# EAGLE design MEGA-ROS (EAGLE 7.6.0)
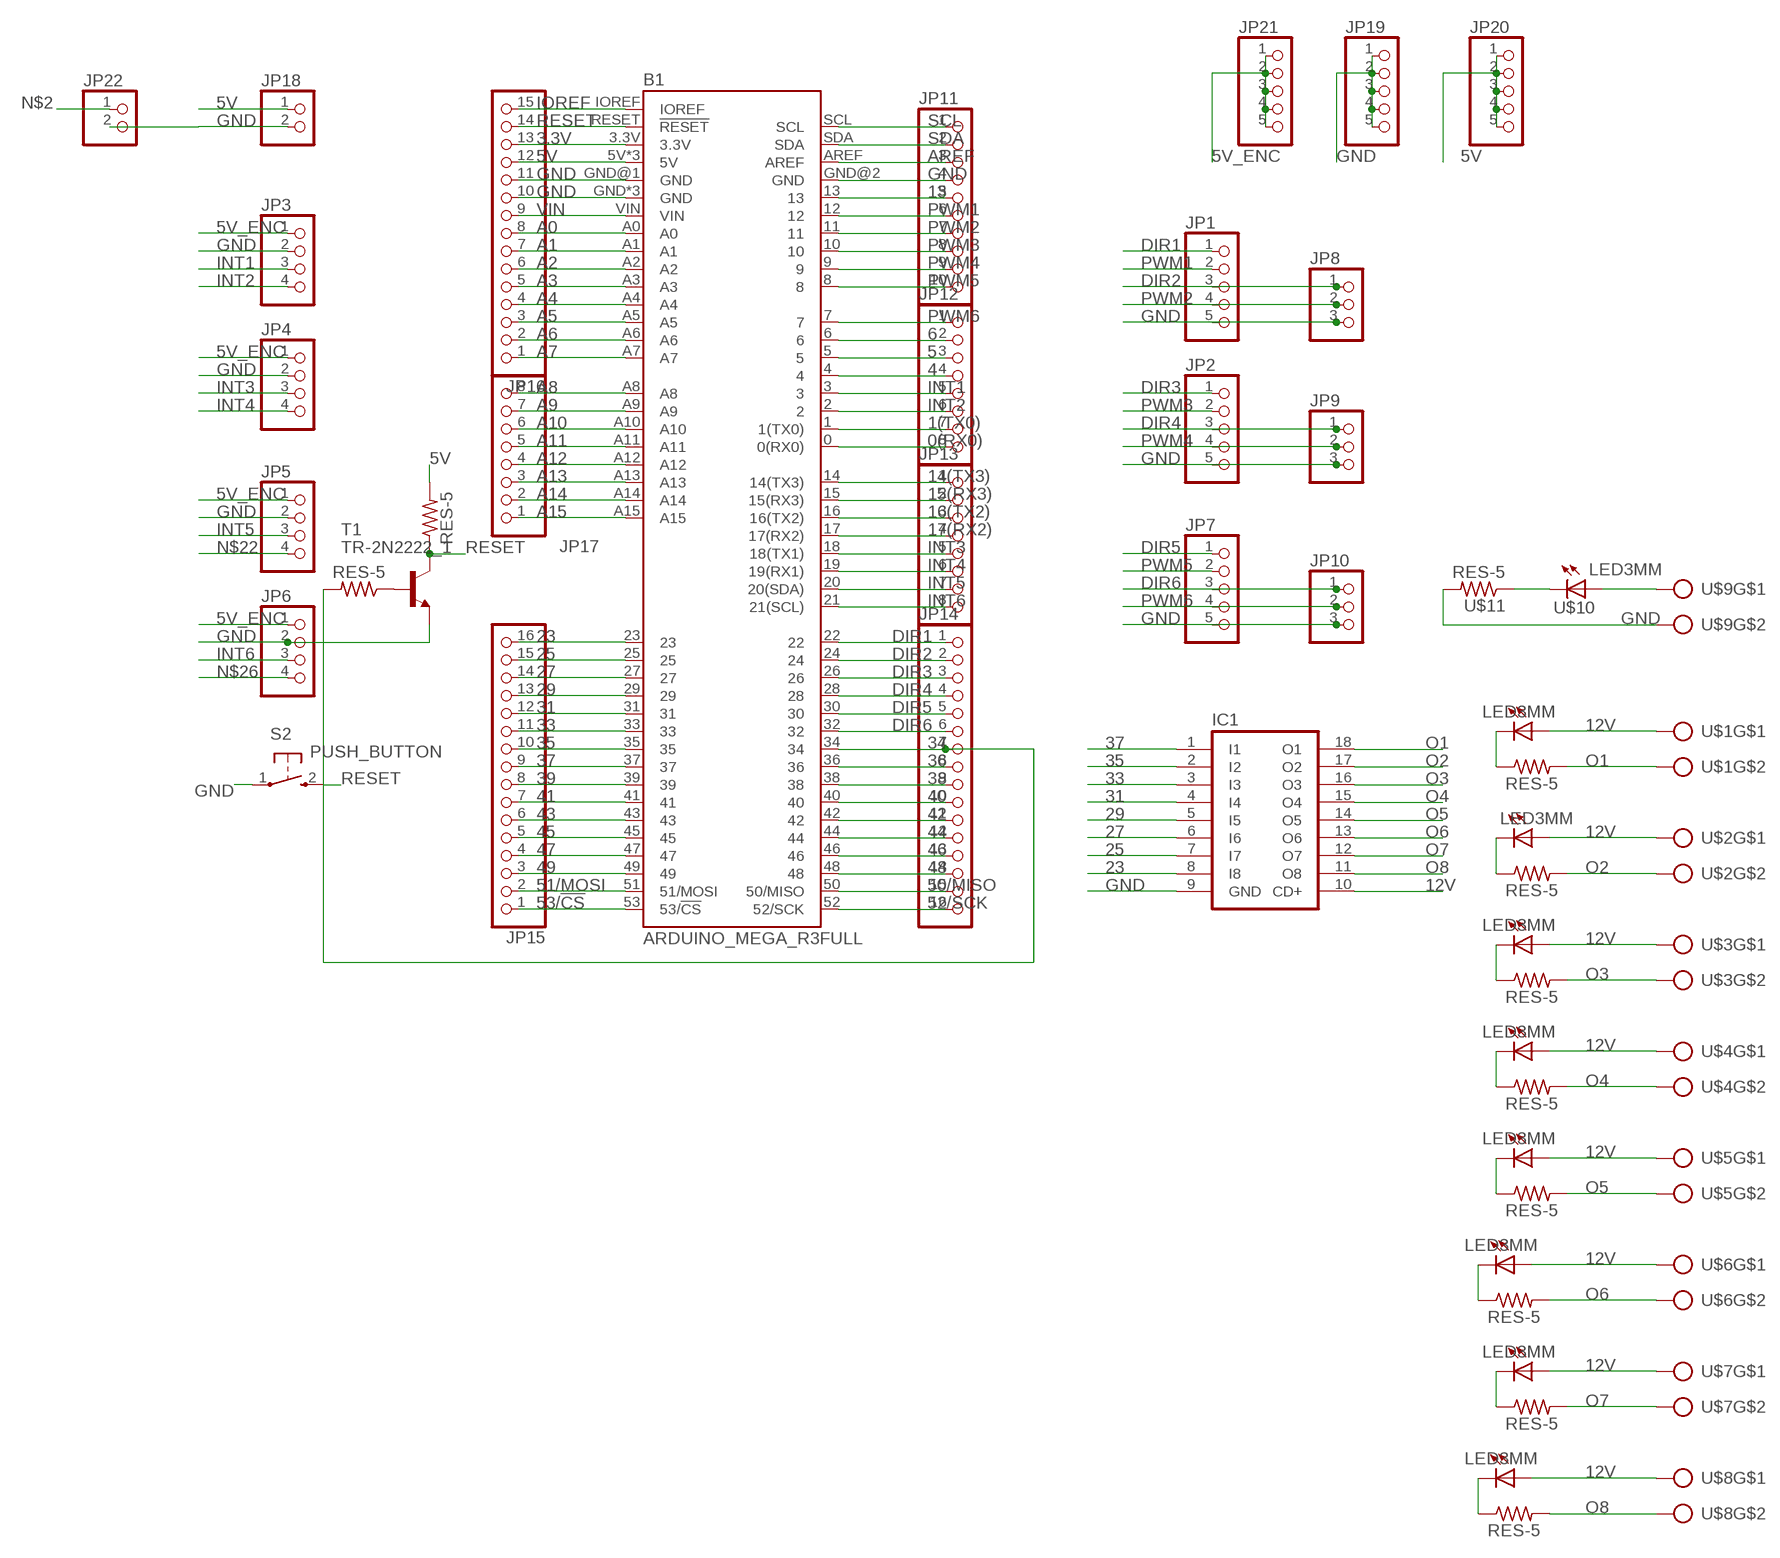
[diagram p0: schematic, sheet 1]

## Parts
B1  ARDUINO_MEGA_R3FULL  [ARDUINO_MEGA_NO_SILK]
IC1  ULN2803A  [DIL18]
JP1  PINHD-5_DATA  [1X05_DATA]
JP2  PINHD-5_DATA  [1X05_DATA]
JP3  PINHD-4_DATA  [1X04_DATA]
JP4  PINHD-4_DATA  [1X04_DATA]
JP5  PINHD-4_DATA  [1X04_DATA]
JP6  PINHD-4_DATA  [1X04_DATA]
JP7  PINHD-5_DATA  [1X05_DATA]
JP8  PINHD-3_DATA  [1X03_DATA]
JP9  PINHD-3_DATA  [1X03_DATA]
JP10  PINHD-3_DATA  [1X03_DATA]
JP11  PINHD-1X10  [1X10]
JP12  PINHD-1X8  [1X08]
JP13  PINHD-1X8  [1X08]
JP14  PINHD-1X16  [1X16]
JP15  PINHD-1X16  [1X16]
JP16  PINHD-1X15  [1X15]
JP17  PINHD-1X8  [1X08]
JP18  PINHD-2_DATA  [1X02_DATA]
JP19  PINHD-1X5  [1X05]
JP20  PINHD-1X5  [1X05]
JP21  PINHD-1X5  [1X05]
JP22  PINHD-2_DATA  [1X02_DATA]
S2  PUSH_BUTTON  [B3F-10XX]
T1  TR-2N2222_1  [TO92-EBC]
U$1  CON_PTR_2  [AK300/2]
U$2  CON_PTR_2  [AK300/2]
U$3  CON_PTR_2  [AK300/2]
U$4  CON_PTR_2  [AK300/2]
U$5  CON_PTR_2  [AK300/2]
U$6  CON_PTR_2  [AK300/2]
U$7  CON_PTR_2  [AK300/2]
U$8  CON_PTR_2  [AK300/2]
U$9  CON_PTR_2  [AK300/2]
U$10  LED3MM  [LED3MM]
U$11  RES-5  [0204/5]
U$12  LED3MM  [LED3MM]
U$13  RES-5  [0204/5]
U$14  LED3MM  [LED3MM]
U$15  RES-5  [0204/5]
U$16  LED3MM  [LED3MM]
U$17  RES-5  [0204/5]
U$18  LED3MM  [LED3MM]
U$19  RES-5  [0204/5]
U$20  LED3MM  [LED3MM]
U$21  RES-5  [0204/5]
U$22  LED3MM  [LED3MM]
U$23  RES-5  [0204/5]
U$24  LED3MM  [LED3MM]
U$25  RES-5  [0204/5]
U$26  LED3MM  [LED3MM]
U$27  RES-5  [0204/5]
U$28  RES-5  [0204/5]
U$29  RES-5  [0204/5]

## Nets
0(RX0): B1.0(0(RX0)) JP12.8
1(TX0): B1.1(1(TX0)) JP12.7
3.3V: B1.3.3V JP16.13
4: B1.4 JP12.4
5: B1.5 JP12.3
5V: B1.5V B1.5V@1(5V) B1.5V@2(5V) JP16.12 JP18.1 JP20.1 JP20.2 JP20.3 JP20.4 JP20.5 U$28.2
5V_ENC: JP3.1 JP4.1 JP5.1 JP6.1 JP21.1 JP21.2 JP21.3 JP21.4 JP21.5
6: B1.6 JP12.2
12V: IC1.10(CD+) U$1.1 U$2.1 U$3.1 U$4.1 U$5.1 U$6.1 U$7.1 U$8.1 U$12.A U$14.A U$16.A U$18.A U$20.A U$22.A U$24.A U$26.A
13: B1.13 JP11.5
14(TX3): B1.14(14(TX3)) JP13.1
15(RX3): B1.15(15(RX3)) JP13.2
16(TX2): B1.16(16(TX2)) JP13.3
17(RX2): B1.17(17(RX2)) JP13.4
23: B1.23 IC1.8(I8) JP15.16
25: B1.25 IC1.7(I7) JP15.15
27: B1.27 IC1.6(I6) JP15.14
29: B1.29 IC1.5(I5) JP15.13
31: B1.31 IC1.4(I4) JP15.12
33: B1.33 IC1.3(I3) JP15.11
34: B1.34 JP14.7 U$29.2
35: B1.35 IC1.2(I2) JP15.10
36: B1.36 JP14.8
37: B1.37 IC1.1(I1) JP15.9
38: B1.38 JP14.9
39: B1.39 JP15.8
40: B1.40 JP14.10
41: B1.41 JP15.7
42: B1.42 JP14.11
43: B1.43 JP15.6
44: B1.44 JP14.12
45: B1.45 JP15.5
46: B1.46 JP14.13
47: B1.47 JP15.4
48: B1.48 JP14.14
49: B1.49 JP15.3
50/MISO: B1.50(50/MISO) JP14.15
51/MOSI: B1.51(51/MOSI) JP15.2
52/SCK: B1.52(52/SCK) JP14.16
53/!CS: B1.53(53/!CS) JP15.1
A0: B1.A0 JP16.8
A1: B1.A1 JP16.7
A2: B1.A2 JP16.6
A3: B1.A3 JP16.5
A4: B1.A4 JP16.4
A5: B1.A5 JP16.3
A6: B1.A6 JP16.2
A7: B1.A7 JP16.1
A8: B1.A8 JP17.8
A9: B1.A9 JP17.7
A10: B1.A10 JP17.6
A11: B1.A11 JP17.5
A12: B1.A12 JP17.4
A13: B1.A13 JP17.3
A14: B1.A14 JP17.2
A15: B1.A15 JP17.1
AREF: B1.AREF JP11.3
DIR1: B1.22 JP1.1 JP14.1
DIR2: B1.24 JP1.3 JP8.1 JP14.2
DIR3: B1.26 JP2.1 JP14.3
DIR4: B1.28 JP2.3 JP9.1 JP14.4
DIR5: B1.30 JP7.1 JP14.5
DIR6: B1.32 JP7.3 JP10.1 JP14.6
GND: B1.GND B1.GND@1(GND) B1.GND@2(GND) B1.GND@3(GND) B1.GND@4(GND) IC1.9(GND) JP1.5 JP2.5 JP3.2 JP4.2 JP5.2 JP6.2 JP7.5 JP8.3 JP9.3 JP10.3 JP11.4 JP16.10 JP16.11 JP18.2 JP19.1 JP19.2 JP19.3 JP19.4 JP19.5 JP22.2 S2.1(P) T1.E U$9.2 U$11.2
INT1: B1.3 JP3.3 JP12.5
INT2: B1.2 JP3.4 JP12.6
INT3: B1.18(18(TX1)) JP4.3 JP13.5
INT4: B1.19(19(RX1)) JP4.4 JP13.6
INT5: B1.20(20(SDA)) JP5.3 JP13.7
INT6: B1.21(21(SCL)) JP6.3 JP13.8
IOREF: B1.IOREF JP16.15
N$1: U$10.K(C) U$11.1
N$2: JP22.1
N$3: U$12.K(C) U$13.1
N$4: U$14.K(C) U$15.1
N$5: U$16.K(C) U$17.1
N$6: U$18.K(C) U$19.1
N$7: U$20.K(C) U$21.1
N$8: U$22.K(C) U$23.1
N$9: U$24.K(C) U$25.1
N$10: U$26.K(C) U$27.1
N$11: U$9.1 U$10.A
N$12: T1.B U$29.1
N$22: JP5.4
N$26: JP6.4
O1: IC1.18(O1) U$1.2 U$13.2
O2: IC1.17(O2) U$2.2 U$15.2
O3: IC1.16(O3) U$3.2 U$17.2
O4: IC1.15(O4) U$4.2 U$19.2
O5: IC1.14(O5) U$5.2 U$21.2
O6: IC1.13(O6) U$6.2 U$23.2
O7: IC1.12(O7) U$7.2 U$25.2
O8: IC1.11(O8) U$8.2 U$27.2
PWM1: B1.12 JP1.2 JP11.6
PWM2: B1.11 JP1.4 JP8.2 JP11.7
PWM3: B1.10 JP2.2 JP11.8
PWM4: B1.9 JP2.4 JP9.2 JP11.9
PWM5: B1.8 JP7.2 JP11.10
PWM6: B1.7 JP7.4 JP10.2 JP12.1
RESET: B1.RESET(!RESET) JP16.14 S2.2(S) T1.C U$28.1
SCL: B1.SCL JP11.1
SDA: B1.SDA JP11.2
VIN: B1.VIN JP16.9

## Library data of the parts
B1 = MIA_LIBRARY-2-2-2:ARDUINO_MEGA_R3: Arduino Mega R3 ATmega2560 R3 compatible footprint. SparkFun Products: Arduino Mega 2560 R3 <https://www.sparkfun.com/products/11061>
IC1 = MIA_LIBRARY-2-2-2:ULN2803A: DRIVER ARRAY
JP1 JP2 JP7 = MIA_LIBRARY-2-2-2:PINHD-5_DATA: PIN HEADER
JP3-JP6 = MIA_LIBRARY-2-2-2:PINHD-4_DATA: PIN HEADER
JP8-JP10 = MIA_LIBRARY-2-2-2:PINHD-3_DATA: PIN HEADER
JP11 = pinhead:PINHD-1X10: PIN HEADER
JP12 JP13 JP17 = pinhead:PINHD-1X8: PIN HEADER
JP14 JP15 = pinhead:PINHD-1X16: PIN HEADER
JP16 = pinhead:PINHD-1X15: PIN HEADER
JP18 JP22 = MIA_LIBRARY-2-2-2:PINHD-2_DATA: PIN HEADER
JP19-JP21 = pinhead:PINHD-1X5: PIN HEADER
S2 = MIA_LIBRARY-2-2-2:PUSH_BUTTON: OMRON SWITCH
T1 = MIA_LIBRARY-2-2-2:TR-2N2222_1: NPN TRANSISTOR
U$1-U$9 = MIA_LIBRARY-2-2-2:CON_PTR_2
U$10 U$12 U$14 U$16 U$18 U$20 U$22 U$24 U$26 = MIA_LIBRARY-2-2-2:LED3MM
U$11 U$13 U$15 U$17 U$19 U$21 U$23 U$25 U$27-U$29 = MIA_LIBRARY-2-2-2:RES-5

## Board
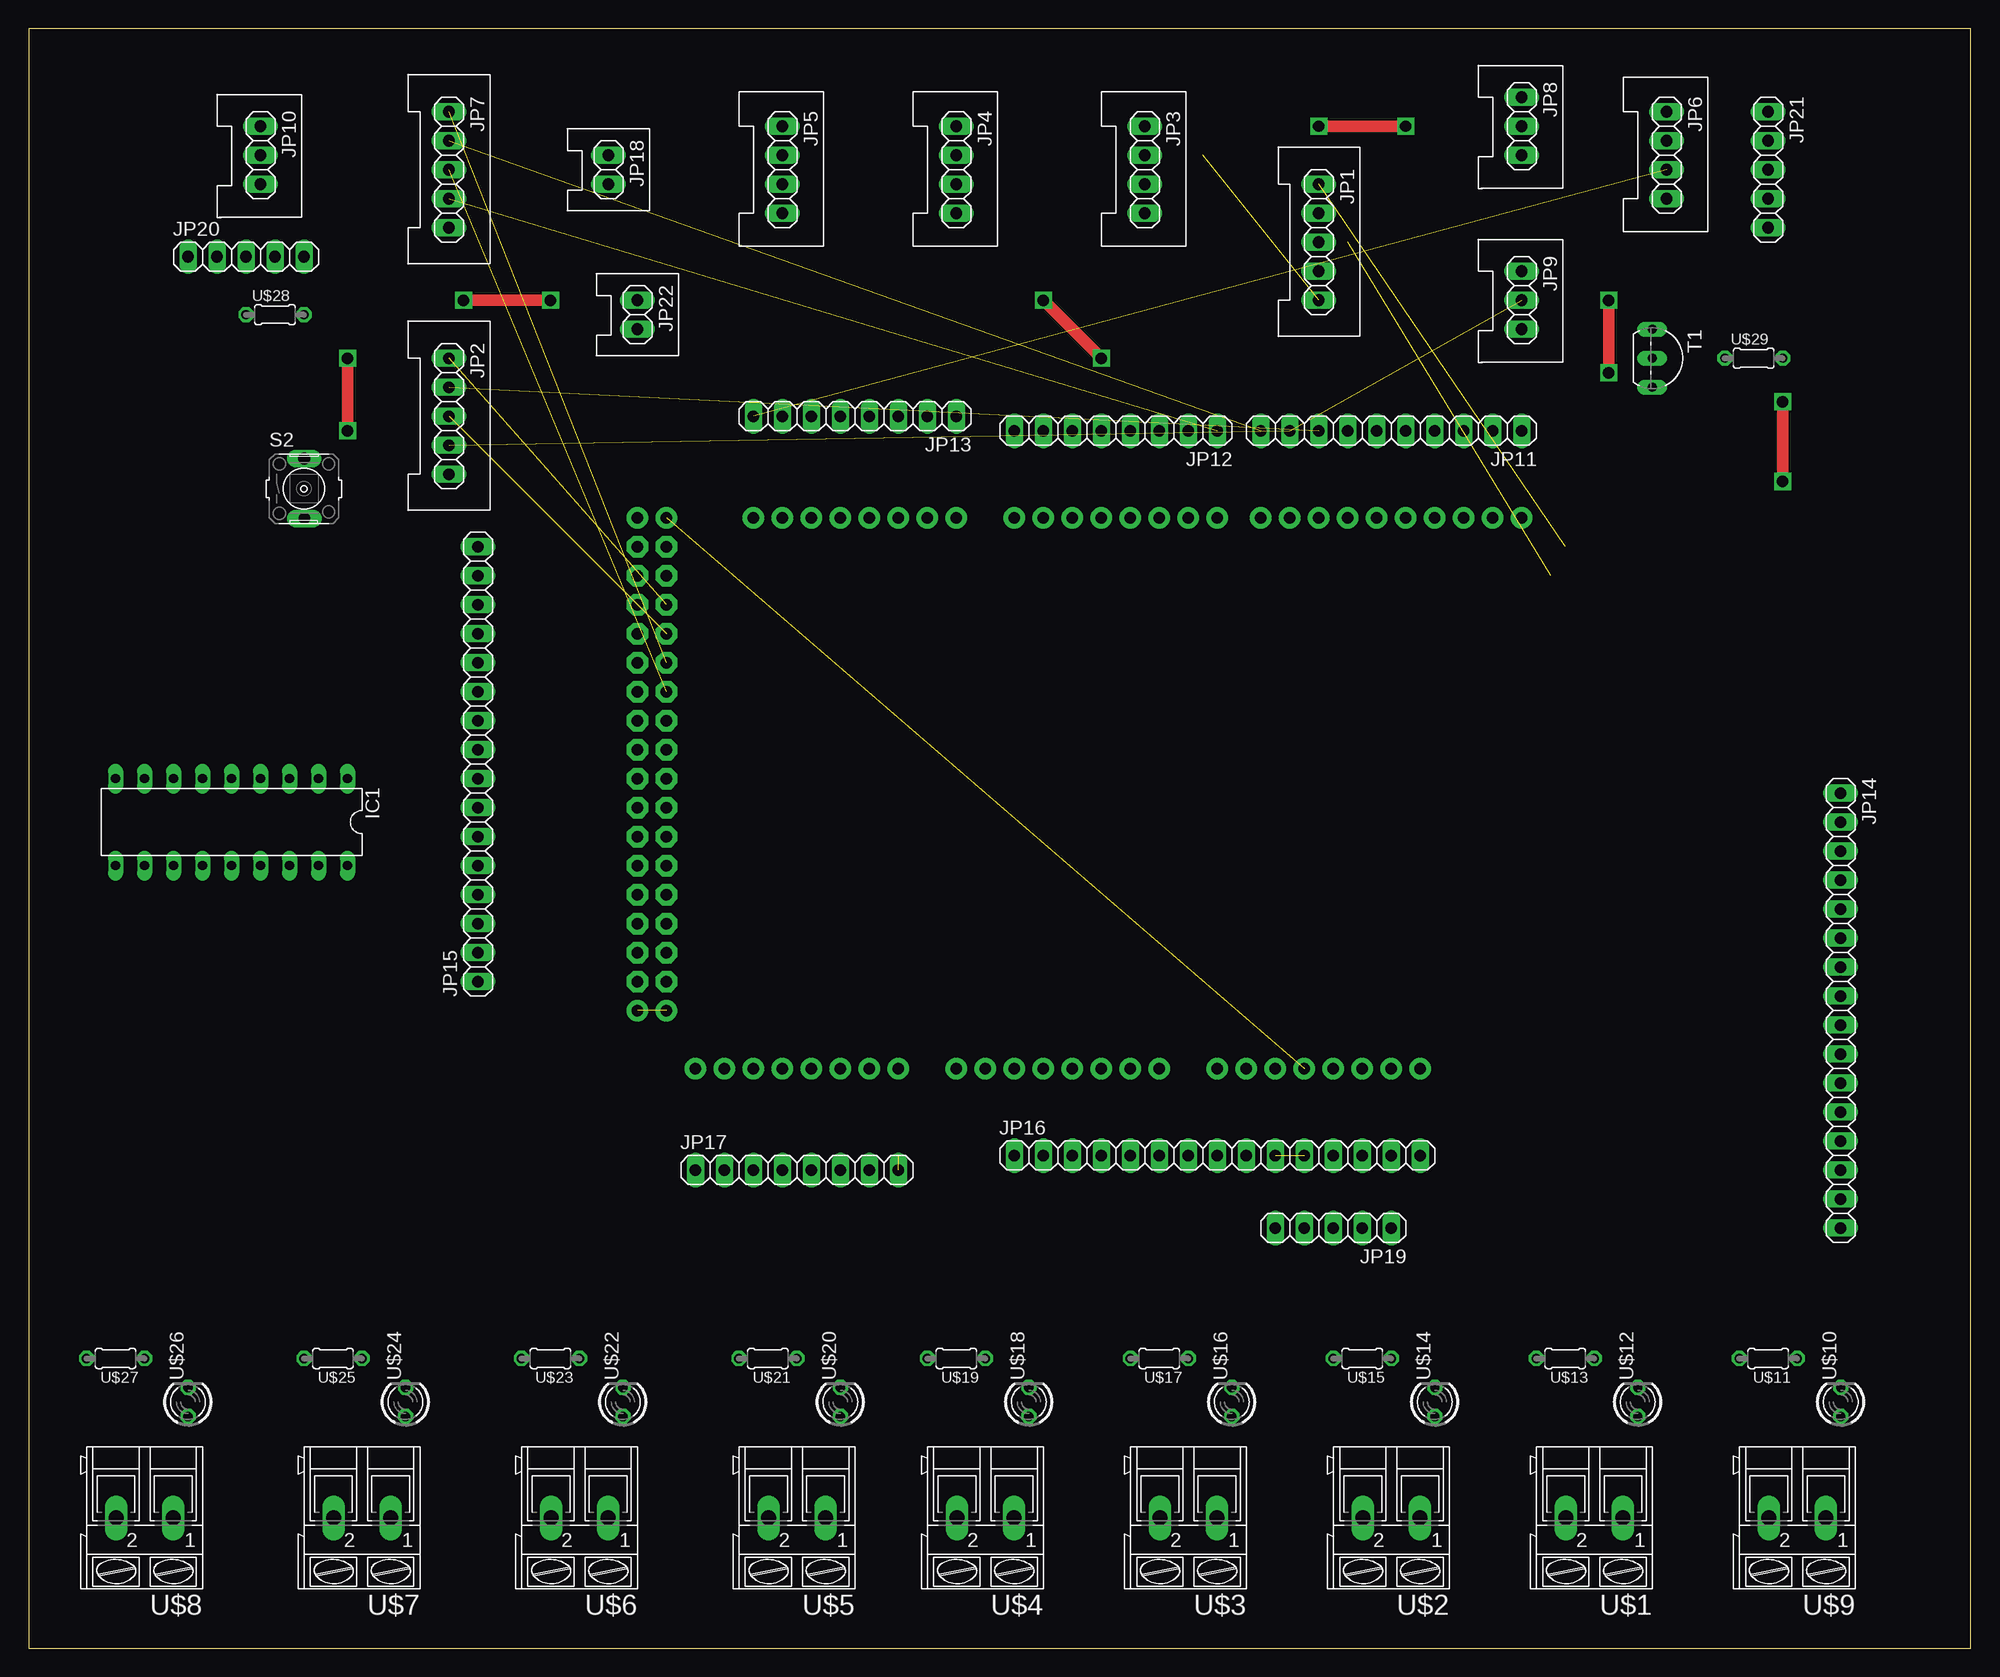
[diagram p1: board, top side]
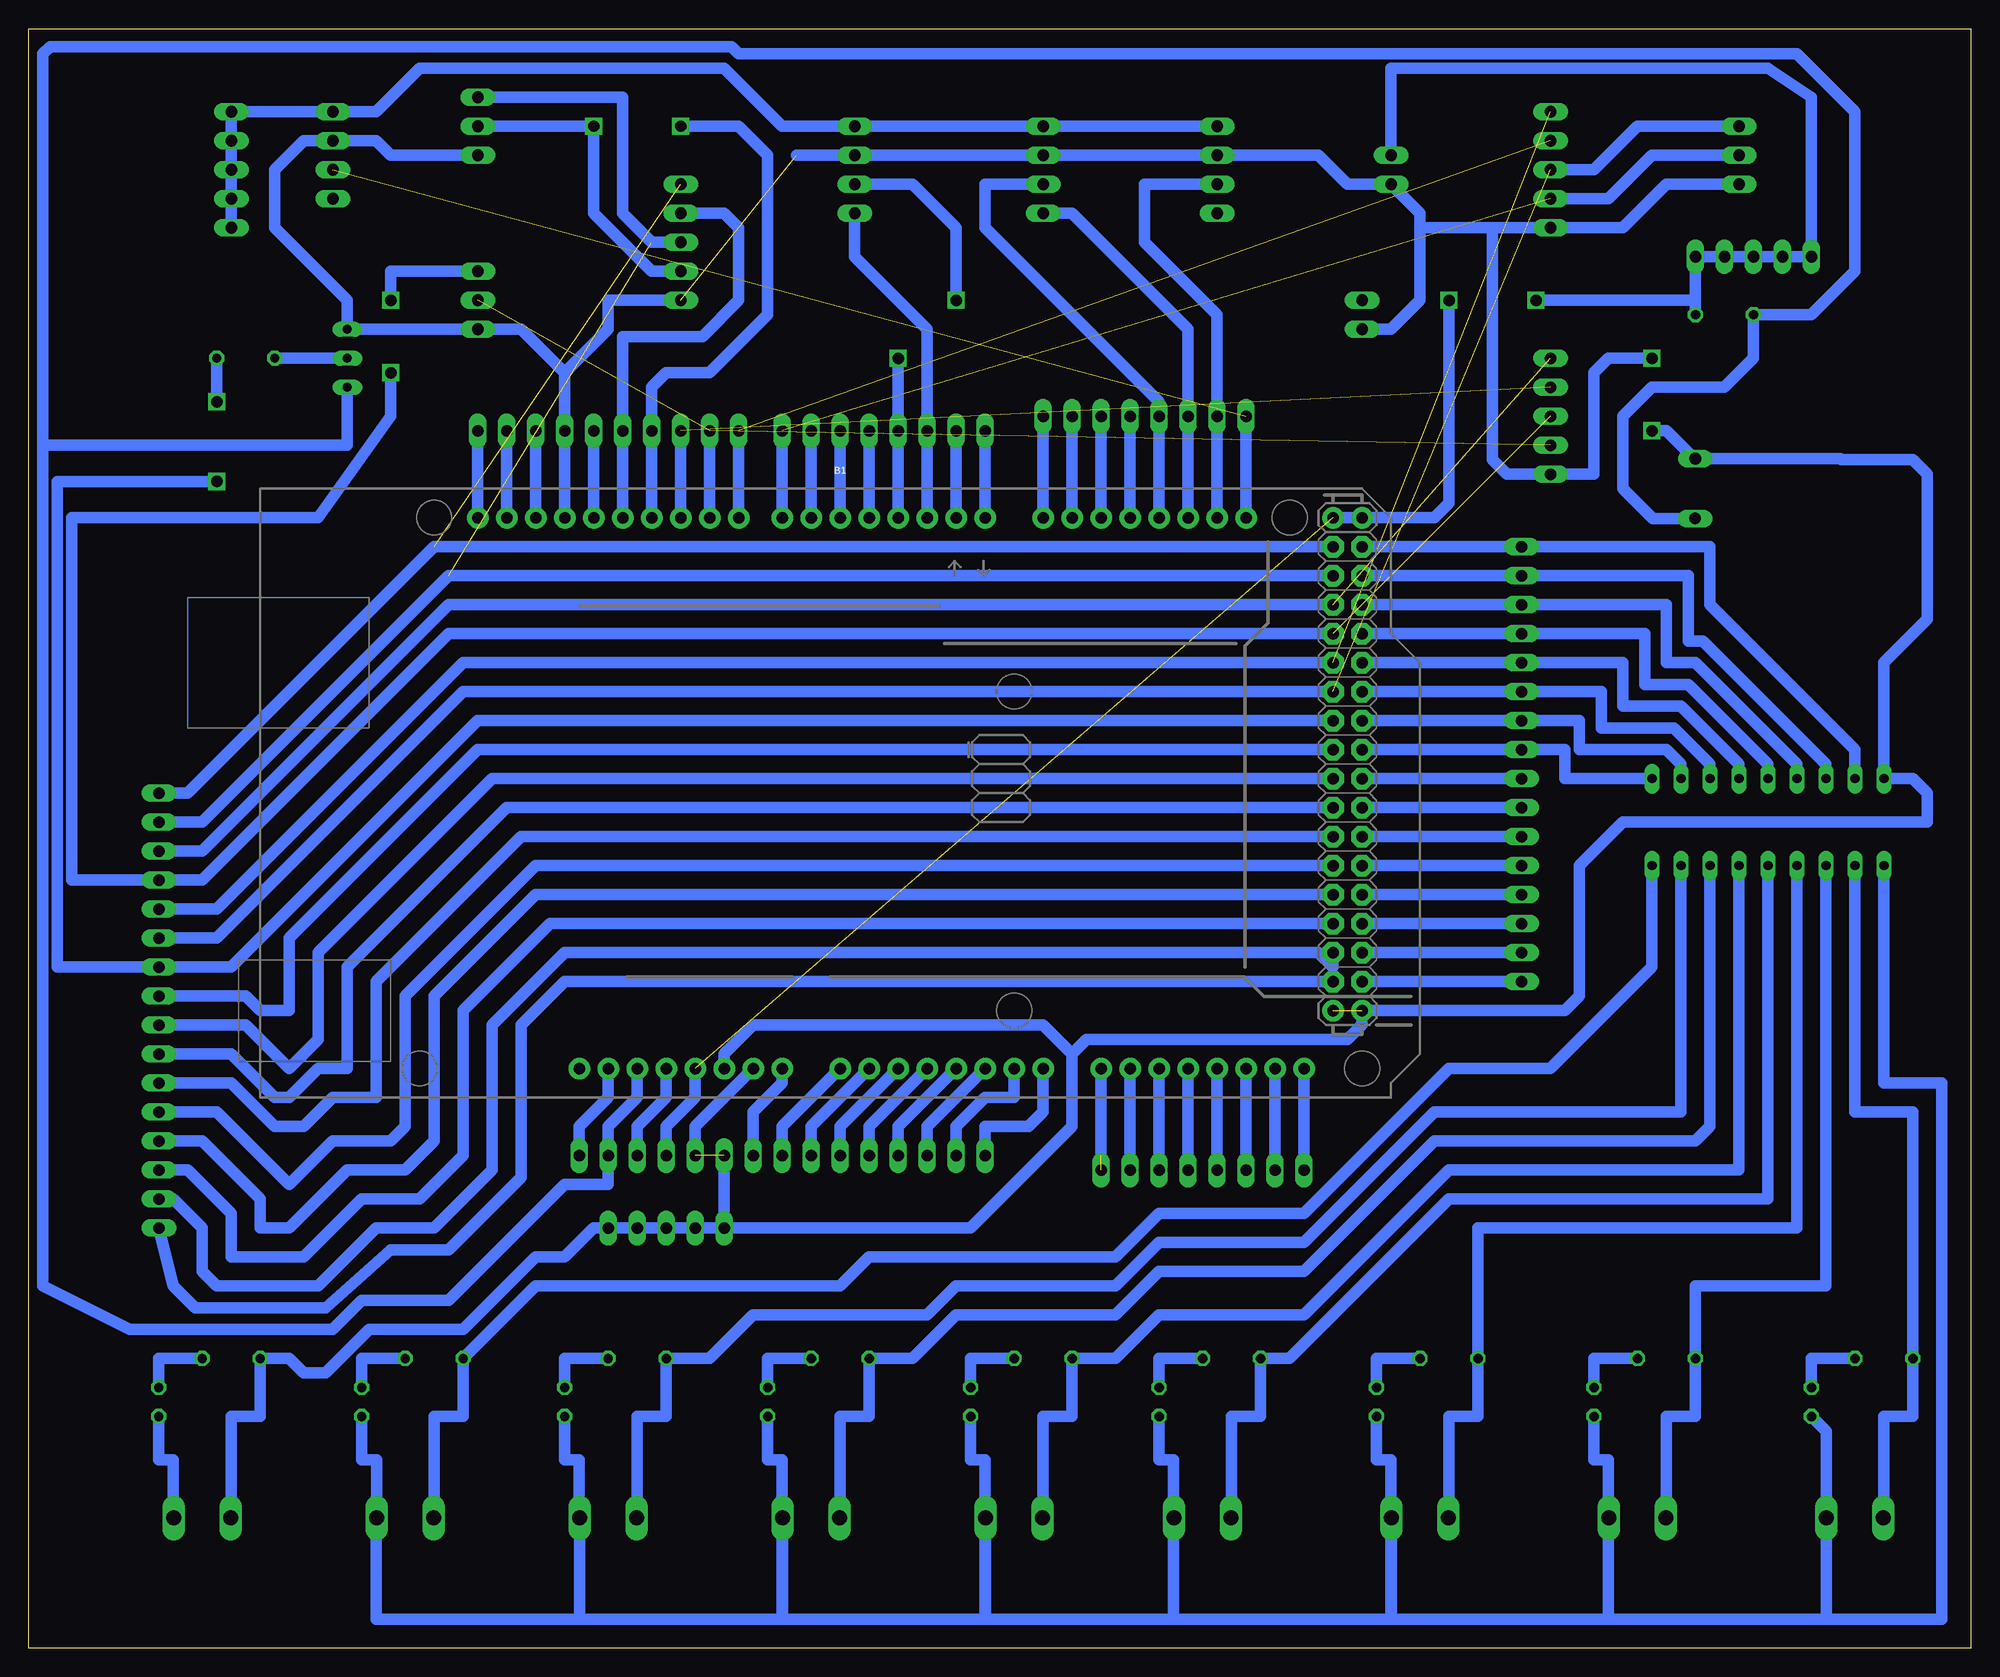
[diagram p2: board, bottom side, seen from below]

Size 170.16 x 141.91 mm. Coordinates in mm from the lower left corner, seen from the top.
Outline: 0,0 170.16,0 170.16,141.91 0,141.91 0,0
Copper layers (1*16): Top 0.035mm / dielectric 1.5mm / Bottom 0.035mm
Design rules "default": minimum track width 10mil, minimum drill 24mil, track to track 8mil, track to pad 8mil, pad to pad 8mil, via to via 8mil, smd to smd 8mil, copper to edge 40mil, drill to drill 8mil, minimum pad ring 10mil, minimum via ring 8mil, stop-mask expansion 4mil, vias tented up to drill 0mil, thermal gap 10mil

### Footprints (pad centres in the part's own frame; a part is rotated, then mirrored left to right if it is on the bottom)
ARDUINO_MEGA_NO_SILK = drill 1.016 pad 1.88: 0 13.97,24.13; 1 11.43,24.13; 2 8.89,24.13; 3 6.35,24.13; 3.3V -13.97,-24.13; 4 3.81,24.13; 5 1.27,24.13; 5V -11.43,-24.13; 5V@1 44.45,24.13; 5V@2 46.99,24.13; 6 -1.27,24.13; 7 -3.81,24.13; 8 -7.62,24.13; 9 -10.16,24.13; 10 -12.7,24.13; 11 -15.24,24.13; 12 -17.78,24.13; 13 -20.32,24.13; 14 19.05,24.13; 15 21.59,24.13; 16 24.13,24.13; 17 26.67,24.13; 18 29.21,24.13; 19 31.75,24.13; 20 34.29,24.13; 21 36.83,24.13; A0 1.27,-24.13; A1 3.81,-24.13; A2 6.35,-24.13; A3 8.89,-24.13; A4 11.43,-24.13; A5 13.97,-24.13; A6 16.51,-24.13; A7 19.05,-24.13; A8 24.13,-24.13; A9 26.67,-24.13; A10 29.21,-24.13; A11 31.75,-24.13; A12 34.29,-24.13; A13 36.83,-24.13; A14 39.37,-24.13; A15 41.91,-24.13; AREF -25.4,24.13; GND -8.89,-24.13; GND@1 -6.35,-24.13; GND@2 44.45,-19.05; GND@3 46.99,-19.05; GND@4 -22.86,24.13; IOREF -19.05,-24.13; NC -21.59,-24.13; RESET -16.51,-24.13; SCL -30.48,24.13; SDA -27.94,24.13; VIN -3.81,-24.13 | drill 1.016 pad 1.88 octagon: 22 44.45,21.59; 23 46.99,21.59; 24 44.45,19.05; 25 46.99,19.05; 26 44.45,16.51; 27 46.99,16.51; 28 44.45,13.97; 29 46.99,13.97; 30 44.45,11.43; 31 46.99,11.43; 32 44.45,8.89; 33 46.99,8.89; 34 44.45,6.35; 35 46.99,6.35; 36 44.45,3.81; 37 46.99,3.81; 38 44.45,1.27; 39 46.99,1.27; 40 44.45,-1.27; 41 46.99,-1.27; 42 44.45,-3.81; 43 46.99,-3.81; 44 44.45,-6.35; 45 46.99,-6.35; 46 44.45,-8.89; 47 46.99,-8.89; 48 44.45,-11.43; 49 46.99,-11.43; 50 44.45,-13.97; 51 46.99,-13.97; 52 44.45,-16.51; 53 46.99,-16.51
DIL18 = drill 0.813 long: 1 -10.16,-3.81; 2 -7.62,-3.81; 3 -5.08,-3.81; 4 -2.54,-3.81; 5 0,-3.81; 6 2.54,-3.81; 7 5.08,-3.81; 8 7.62,-3.81; 9 10.16,-3.81; 10 10.16,3.81; 11 7.62,3.81; 12 5.08,3.81; 13 2.54,3.81; 14 0,3.81; 15 -2.54,3.81; 16 -5.08,3.81; 17 -7.62,3.81; 18 -10.16,3.81
1X05_DATA = drill 1.016 long: 1 -5.08,0; 2 -2.54,0; 3 0,0; 4 2.54,0; 5 5.08,0
1X04_DATA = drill 1.016 long: 1 -3.81,0; 2 -1.27,0; 3 1.27,0; 4 3.81,0
1X03_DATA = drill 1.016 long: 1 -2.54,0; 2 0,0; 3 2.54,0
1X10 = drill 1.016 long: 1 -11.43,0; 2 -8.89,0; 3 -6.35,0; 4 -3.81,0; 5 -1.27,0; 6 1.27,0; 7 3.81,0; 8 6.35,0; 9 8.89,0; 10 11.43,0
1X08 = drill 1.016 long: 1 -8.89,0; 2 -6.35,0; 3 -3.81,0; 4 -1.27,0; 5 1.27,0; 6 3.81,0; 7 6.35,0; 8 8.89,0
1X16 = drill 1.016 long: 1 -19.05,0; 2 -16.51,0; 3 -13.97,0; 4 -11.43,0; 5 -8.89,0; 6 -6.35,0; 7 -3.81,0; 8 -1.27,0; 9 1.27,0; 10 3.81,0; 11 6.35,0; 12 8.89,0; 13 11.43,0; 14 13.97,0; 15 16.51,0; 16 19.05,0
1X15 = drill 1.016 long: 1 -17.78,0; 2 -15.24,0; 3 -12.7,0; 4 -10.16,0; 5 -7.62,0; 6 -5.08,0; 7 -2.54,0; 8 0,0; 9 2.54,0; 10 5.08,0; 11 7.62,0; 12 10.16,0; 13 12.7,0; 14 15.24,0; 15 17.78,0
1X02_DATA = drill 1.016 long: 1 -1.27,0; 2 1.27,0
1X05 = drill 1.016 long: 1 -5.08,0; 2 -2.54,0; 3 0,0; 4 2.54,0; 5 5.08,0
B3F-10XX = drill 1.016 long: 1 0.013,2.636; 2 0.029,-2.605
TO92-EBC = drill 0.813 long: B 0,-1.27; C 2.54,-1.27; E -2.54,-1.27
AK300/2 = drill 1.321 long: 1 -2.515,0; 2 2.489,0
LED3MM = drill 0.813 octagon: A -1.27,0; K 1.27,0
0204/5 = drill 0.813 octagon: 1 -2.54,0; 2 2.54,0

### Placement (x,y rotation side)
B1  100.33,74.93 0 bottom
IC1  17.78,72.39 180 top
JP1  113.03,123.19 270 top
JP2  36.83,107.95 270 top
JP3  97.79,129.54 270 top
JP4  81.28,129.54 270 top
JP5  66.04,129.54 270 top
JP6  143.51,130.81 270 top
JP7  36.83,129.54 270 top
JP8  130.81,133.35 270 top
JP9  130.81,118.11 270 top
JP10  20.32,130.81 270 top
JP11  119.38,106.68 180 top
JP12  95.25,106.68 180 top
JP13  72.39,107.95 180 top
JP14  158.75,55.88 270 top
JP15  39.37,77.47 90 top
JP16  104.14,43.18 0 top
JP17  67.31,41.91 0 top
JP18  50.8,129.54 270 top
JP19  114.3,36.83 180 top
JP20  19.05,121.92 0 top
JP21  152.4,129.54 270 top
JP22  53.34,116.84 270 top
S2  24.13,101.6 0 top
T1  143.51,113.03 270 top
U$1  137.16,11.43 180 top
U$2  119.38,11.43 180 top
U$3  101.6,11.43 180 top
U$4  83.82,11.43 180 top
U$5  67.31,11.43 180 top
U$6  48.26,11.43 180 top
U$7  29.21,11.43 180 top
U$8  10.16,11.43 180 top
U$9  154.94,11.43 180 top
U$10  158.75,21.59 90 top
U$11  152.4,25.4 180 top
U$12  140.97,21.59 90 top
U$13  134.62,25.4 180 top
U$14  123.19,21.59 90 top
U$15  116.84,25.4 180 top
U$16  105.41,21.59 90 top
U$17  99.06,25.4 180 top
U$18  87.63,21.59 90 top
U$19  81.28,25.4 180 top
U$20  71.12,21.59 90 top
U$21  64.77,25.4 180 top
U$22  52.07,21.59 90 top
U$23  45.72,25.4 180 top
U$24  33.02,21.59 90 top
U$25  26.67,25.4 180 top
U$26  13.97,21.59 90 top
U$27  7.62,25.4 180 top
U$28  21.59,116.84 0 top
U$29  151.13,113.03 0 top

### Tracks (layer width: path | path; a pad name or v marks a point on that pad's centre or on a via)
0(RX0)
  Bottom 1.016: JP12.8 B1.0
1(TX0)
  Bottom 1.016: JP12.7 B1.1
3.3V
  Bottom 1.016: JP16.13 116.84,45.72 114.3,48.26 B1.3.3V
4
  Bottom 1.016: JP12.4 B1.4
5
  Bottom 1.016: JP12.3 B1.5
5V  (via drill 1)  (1 unrouted)
  Top 1.016: v38.1,118.11 v45.72,118.11
  Bottom 1.016: U$28.2 24.13,118.11 | JP16.12 114.3,45.72 111.76,48.26 B1.5V | JP20.5 JP20.4 JP20.3 JP20.2 JP20.1 | B1.5V@1 B1.5V@2 46.99,99.06 45.72,100.33 v45.72,118.11 | JP18.1 50.8,138.43 17.78,138.43 13.97,135.89 JP20.1 | JP20.1 JP20.5 | JP20.5 24.13,118.11 | 24.13,118.11 v38.1,118.11
5V_ENC
  Bottom 1.016: JP21.5 JP21.4 JP21.3 JP21.2 JP21.1 JP6.1 139.7,134.62 135.89,138.43 109.22,138.43 104.14,133.35 JP3.1 JP4.1 JP5.1
6
  Bottom 1.016: JP12.2 B1.6
12V
  Bottom 1.016: 12.67,2.56 U$8.1 12.67,19.02 U$26.A | 12.67,2.56 12.7,2.54 31.75,2.54 | 31.75,2.54 31.75,11.41 U$7.1 31.75,11.43 31.75,16.51 33.02,16.51 U$24.A | 31.75,2.54 50.8,2.54 | 50.8,2.54 50.8,11.43 | 50.8,2.54 50.78,2.56 U$6.1 50.8,11.43 | 50.8,2.54 69.85,2.54 | 69.85,2.54 69.85,11.41 U$5.1 69.85,11.43 69.85,16.51 71.12,16.51 U$20.A | 69.85,2.54 86.36,2.54 | 86.36,2.54 86.36,11.41 U$4.1 | U$4.1 86.34,2.56 86.36,2.54 | 86.36,2.54 104.14,2.54 | 104.14,2.54 104.14,11.41 U$3.1 | U$3.1 104.12,2.56 104.14,2.54 | 104.14,2.54 121.89,2.54 | 121.89,2.54 139.7,2.54 139.7,11.41 U$1.1 139.67,16.51 140.97,16.51 U$12.A | U$22.A 52.07,16.51 50.8,16.51 50.8,11.43 | U$18.A 87.63,16.51 86.36,16.51 86.36,11.43 U$4.1 | U$16.A 105.41,16.51 104.14,16.51 104.14,11.43 U$3.1 | U$2.1 121.89,10.16 | 121.89,10.16 121.89,2.54 | U$14.A 123.19,16.51 121.92,16.51 121.92,10.16 121.89,10.16 | IC1.10 7.62,49.53 2.54,49.53 2.54,2.56 12.67,2.56
13
  Bottom 1.016: JP11.5 B1.13
14(TX3)
  Bottom 1.016: JP13.1 B1.14
15(RX3)
  Bottom 1.016: JP13.2 B1.15
16(TX2)
  Bottom 1.016: JP13.3 B1.16
17(RX2)
  Bottom 1.016: JP13.4 B1.17
23
  Bottom 1.016: IC1.8 10.16,78.74 22.86,91.44 22.86,96.52 JP15.16 B1.23
25
  Bottom 1.016: IC1.7 12.7,77.47 23.49,88.27 24.77,88.27 24.77,93.98 JP15.15 B1.25
27
  Bottom 1.016: IC1.6 15.24,77.47 24.13,86.36 26.67,86.36 26.67,91.44 JP15.14 B1.27
29
  Bottom 1.016: IC1.5 17.78,77.47 24.77,84.45 28.57,84.45 28.57,88.9 JP15.13 B1.29
31
  Bottom 1.016: IC1.4 20.32,77.47 25.4,82.55 30.48,82.55 30.48,86.36 JP15.12 B1.31
33
  Bottom 1.016: IC1.3 22.86,77.47 26.04,80.64 32.38,80.64 32.38,83.82 JP15.11 B1.33
34  (via drill 1)
  Top 1.016: v153.67,109.22 v153.67,102.23
  Bottom 1.016: B1.34 130.81,81.28 152.4,59.69 JP14.7 167.64,59.69 167.64,102.23 v153.67,102.23 | U$29.2 v153.67,109.22
35
  Bottom 1.016: IC1.2 25.4,77.47 26.67,78.74 34.29,78.74 34.29,81.28 JP15.10 B1.35
36
  Bottom 1.016: B1.36 130.81,78.74 147.32,62.23 147.32,55.88 149.86,55.88 151.13,57.15 JP14.8
37
  Bottom 1.016: IC1.1 35.56,76.2 35.56,78.74 JP15.9 B1.37
38
  Bottom 1.016: JP14.9 151.13,54.61 147.32,50.8 144.78,53.34 144.78,60.96 129.54,76.2 B1.38
39
  Bottom 1.016: B1.39 JP15.8
40
  Bottom 1.016: B1.40 128.27,73.66 142.24,59.69 142.24,50.8 144.78,50.8 147.32,48.26 148.59,48.26 152.4,52.07 JP14.10
41
  Bottom 1.016: JP15.7 B1.41
42
  Bottom 1.016: JP14.11 152.4,49.53 148.59,45.72 146.05,45.72 143.51,48.26 139.7,48.26 139.7,58.42 127,71.12 B1.42
43
  Bottom 1.016: B1.43 JP15.6
44
  Bottom 1.016: B1.44 125.73,68.58 137.16,57.15 137.16,45.72 138.43,44.45 143.51,44.45 147.32,40.64 153.67,46.99 JP14.12
45
  Bottom 1.016: JP15.5 B1.45
46
  Bottom 1.016: JP14.13 154.94,44.45 149.86,39.37 149.86,36.83 147.32,36.83 142.24,41.91 137.16,41.91 134.62,44.45 134.62,57.15 125.73,66.04 B1.46
47
  Bottom 1.016: JP15.4 B1.47
48
  Bottom 1.016: B1.48 124.46,63.5 132.08,55.88 132.08,43.18 135.89,39.37 140.97,39.37 146.05,34.29 152.4,34.29 152.4,38.1 156.21,41.91 JP14.14
49
  Bottom 1.016: B1.49 JP15.3
50/MISO
  Bottom 1.016: JP14.15 157.48,39.37 154.94,36.83 154.94,33.02 153.67,31.75 144.78,31.75 139.7,36.83 134.62,36.83 129.54,41.91 129.54,54.61 123.19,60.96 57.15,60.96 55.88,59.69 B1.50
51/MOSI
  Bottom 1.016: JP15.2 B1.51
52/SCK
  Bottom 1.016: JP14.16 157.48,31.75 155.57,29.84 144.14,29.84 138.43,34.92 133.35,34.92 127,41.27 127,54.61 123.19,58.42 B1.52
53/!CS
  Bottom 1.016: JP15.1 B1.53
A0
  Bottom 1.016: JP16.8 104.14,45.72 B1.A0
A1
  Bottom 1.016: JP16.7 101.6,45.72 B1.A1
A2
  Bottom 1.016: JP16.6 99.06,45.72 B1.A2
A3
  Bottom 1.016: JP16.5 96.52,45.72 B1.A3
A4
  Bottom 1.016: JP16.4 93.98,45.72 B1.A4
A5
  Bottom 1.016: B1.A5 91.44,45.72 JP16.3
A6
  Bottom 1.016: JP16.2 88.9,45.72 86.36,48.26 83.82,48.26 B1.A6
A7
  Bottom 1.016: B1.A7 81.28,46.99 82.55,45.72 86.36,45.72 JP16.1
A8  (1 unrouted)
  Bottom 1.016: B1.A8 76.2,43.18
A9
  Bottom 1.016: JP17.7 B1.A9
A10
  Bottom 1.016: JP17.6 B1.A10
A11
  Bottom 1.016: JP17.5 B1.A11
A12
  Bottom 1.016: JP17.4 B1.A12
A13
  Bottom 1.016: JP17.3 B1.A13
A14
  Bottom 1.016: JP17.2 B1.A14
A15
  Bottom 1.016: JP17.1 B1.A15
AREF
  Bottom 1.016: JP11.3 B1.AREF
DIR1  (1 unrouted)
  Bottom 1.016: B1.22 134.62,96.52 156.21,74.93 JP14.1
DIR2  (1 unrouted)
  Bottom 1.016: JP14.2 154.94,72.39 133.35,93.98 B1.24 | JP1.3 115.57,123.19 118.11,125.73 118.11,135.89 JP8.1
DIR3  (1 unrouted)
  Bottom 1.016: B1.26 133.35,91.44 154.94,69.85 JP14.3
DIR4  (via drill 1)  (1 unrouted)
  Top 1.016: v138.43,118.11 v138.43,111.76
  Bottom 1.016: B1.28 133.35,88.9 154.94,67.31 JP14.4 166.37,67.31 166.37,99.06 144.78,99.06 138.43,107.95 v138.43,111.76 | JP9.1 138.43,120.65 v138.43,118.11
DIR5  (1 unrouted)
  Bottom 1.016: B1.30 132.08,86.36 153.67,64.77 JP14.5
DIR6  (1 unrouted)
  Bottom 1.016: JP14.6 153.67,62.23 132.08,83.82 B1.32 | JP10.1 29.21,133.35 33.02,129.54 JP7.3
GND  (via drill 1)  (3 unrouted)
  Top 1.016: v27.94,113.03 v27.94,106.68
  Bottom 1.016: U$9.2 152.4,11.43 152.4,20.32 149.86,20.32 U$11.2 147.32,25.4 146.05,24.13 144.14,24.13 140.34,27.94 132.08,27.94 125.73,34.29 123.19,34.29 120.65,36.83 JP19.1 JP19.5 | JP19.5 JP19.4 | JP19.5 JP19.3 | JP19.5 JP19.2 | JP16.10 JP19.5 | JP19.5 87.63,36.83 78.74,45.72 78.74,52.07 | 78.74,52.07 81.28,54.61 106.68,54.61 109.22,52.07 B1.GND | 78.74,52.07 77.47,53.34 54.61,53.34 53.34,54.61 B1.GND@3 35.56,55.88 34.29,57.15 34.29,68.58 30.48,72.39 3.81,72.39 3.81,74.93 5.08,76.2 IC1.9 7.62,86.36 3.81,90.17 3.81,102.87 5.08,104.14 11.35,104.14 11.44,104.24 S2.1 24.23,104.24 26.67,106.68 v27.94,106.68 | JP16.11 111.76,45.72 B1.GND@1 | JP8.3 138.43,130.81 139.7,132.08 JP6.2 146.05,132.08 148.59,129.54 148.59,124.46 142.24,118.11 T1.E JP9.3 127,115.57 123.19,111.76 | 123.19,111.76 JP11.4 B1.GND@4 | JP22.2 50.8,115.57 48.26,118.11 48.26,124.46 | JP10.3 26.67,128.27 30.48,124.46 JP7.5 41.91,124.46 | 48.26,124.46 48.26,125.73 JP18.2 54.61,128.27 57.15,130.81 JP5.2 JP4.2 JP3.2 102.87,130.81 | 48.26,124.46 41.91,124.46 | 41.91,124.46 41.91,104.14 40.64,102.87 JP2.5 33.02,102.87 33.02,111.76 31.75,113.03 v27.94,113.03 | 123.19,111.76 119.38,115.57 119.38,118.11 JP1.5
INT1  (via drill 1)
  Top 1.016: v88.9,118.11 v93.98,113.03
  Bottom 1.016: B1.3 JP12.5 v93.98,113.03 | JP3.3 92.71,128.27 88.9,124.46 v88.9,118.11
INT2
  Bottom 1.016: B1.2 JP12.6 91.44,115.57 97.79,121.92 JP3.4
INT3
  Bottom 1.016: B1.18 JP13.5 71.12,109.22 86.36,124.46 86.36,128.27 JP4.3
INT4
  Bottom 1.016: B1.19 JP13.6 68.58,115.57 78.74,125.73 JP4.4
INT5
  Bottom 1.016: B1.20 JP13.7 66.04,116.84 72.39,123.19 72.39,128.27 JP5.3
INT6  (1 unrouted)
  Bottom 1.016: JP13.8 B1.21
IOREF
  Bottom 1.016: JP16.15 121.92,45.72 119.38,48.26 B1.IOREF
N$1
  Bottom 1.016: U$11.1 158.75,25.4 U$10.K
N$3
  Bottom 1.016: U$12.K 140.97,25.4 U$13.1
N$4
  Bottom 1.016: U$15.1 123.19,25.4 U$14.K
N$5
  Bottom 1.016: U$17.1 105.41,25.4 U$16.K
N$6
  Bottom 1.016: U$18.K 87.63,25.4 U$19.1
N$7
  Bottom 1.016: U$20.K 71.12,25.4 U$21.1
N$8
  Bottom 1.016: U$22.K 52.07,25.4 U$23.1
N$9
  Bottom 1.016: U$24.K 33.02,25.4 U$25.1
N$10
  Bottom 1.016: U$26.K 13.97,25.4 U$27.1
N$11
  Bottom 1.016: U$10.A 158.75,16.51 157.48,16.51 157.48,11.43 | 157.48,10.16 157.48,11.43 | 157.48,11.43 U$9.1
N$12
  Bottom 1.016: T1.B U$29.1
O1
  Bottom 1.016: U$1.2 134.62,11.43 134.62,20.32 132.08,20.32 U$13.2 125.73,31.75 99.06,31.75 96.52,34.29 74.93,34.29 71.12,38.1 58.42,38.1 45.72,50.8 36.83,50.8 27.94,59.69 IC1.18
O2
  Bottom 1.016: U$2.2 116.84,11.43 116.84,20.32 114.3,20.32 U$15.2 110.49,25.4 106.68,29.21 91.44,29.21 88.9,31.75 74.93,31.75 71.12,35.56 58.42,35.56 46.99,46.99 25.4,46.99 IC1.17
O3
  Bottom 1.016: U$3.2 99.06,11.43 99.06,20.32 96.52,20.32 U$17.2 92.71,25.4 88.9,29.21 74.93,29.21 71.12,33.02 58.42,33.02 46.99,44.45 24.13,44.45 22.86,45.72 IC1.16
O4
  Bottom 1.016: U$4.2 81.28,11.43 81.28,20.32 78.74,20.32 U$19.2 74.93,25.4 71.12,29.21 58.42,29.21 45.72,41.91 20.32,41.91 IC1.15
O5
  Bottom 1.016: U$5.2 64.77,11.43 64.77,20.32 62.23,20.32 U$21.2 59.69,25.4 45.72,39.37 17.78,39.37 IC1.14
O6
  Bottom 1.016: U$6.2 45.72,11.43 45.72,20.32 43.18,20.32 U$23.2 43.18,36.83 15.24,36.83 IC1.13
O7
  Bottom 1.016: U$7.2 26.67,11.43 26.67,20.32 24.13,20.32 U$25.2 24.13,31.75 12.7,31.75 IC1.12
O8
  Bottom 1.016: U$8.2 7.62,11.43 7.62,20.32 5.08,20.32 U$27.2 5.08,46.99 10.16,46.99 IC1.11
PWM1
  Bottom 1.016: B1.12 JP11.6 118.11,114.94 111.12,114.94 107.95,118.11 107.95,124.46 109.22,125.73 JP1.2
PWM2  (via drill 1)
  Top 1.016: v120.65,133.35 v113.03,133.35
  Bottom 1.016: B1.11 JP11.7 115.57,110.49 114.3,111.76 110.49,111.76 105.41,116.84 105.41,130.81 107.95,133.35 v113.03,133.35 | JP1.4 115.57,120.65 120.65,125.73 v120.65,133.35 JP8.2
PWM3  (1 unrouted)
  Bottom 1.016: JP11.8 B1.10
PWM4  (2 unrouted)
  Bottom 1.016: JP11.9 B1.9
PWM5  (1 unrouted)
  Bottom 1.016: JP11.10 B1.8
PWM6  (1 unrouted)
  Bottom 1.016: JP12.1 B1.7 | JP7.4 31.75,127 27.94,130.81 JP10.2
RESET
  Bottom 1.016: B1.RESET 116.84,48.26 119.38,45.72 JP16.14 119.38,40.64 123.19,40.64 133.35,30.48 140.97,30.48 143.51,27.94 161.29,27.94 168.91,31.75 168.91,105.41 | 168.91,105.41 142.24,105.41 T1.C | S2.2 27.88,99 30.48,101.6 30.48,107.95 27.94,110.49 21.59,110.49 19.05,113.03 U$28.1 13.97,116.84 10.16,120.65 10.16,134.62 15.24,139.7 107.95,139.7 108.59,140.34 168.27,140.34 168.91,139.7 168.91,105.41
SCL
  Bottom 1.016: JP11.1 B1.SCL
SDA
  Bottom 1.016: JP11.2 B1.SDA
VIN
  Bottom 1.016: JP16.9 106.68,46.99 104.14,49.53 B1.VIN